# EasyEDA Pro project ProProject_J-Link_WiFi_072_V831_Open_2023-09-08.epro, schematic J-Link_WiFi_072_V831

## Sheets
1 V831: Create Date: 2022-09-12; Page Name: V831; Project Name: J-Link_WiFi_072_V831; Schematic Name: J-Link_WiFi_072_V831; Update Date: 2023-04-10; Company: 嘉立创EDA
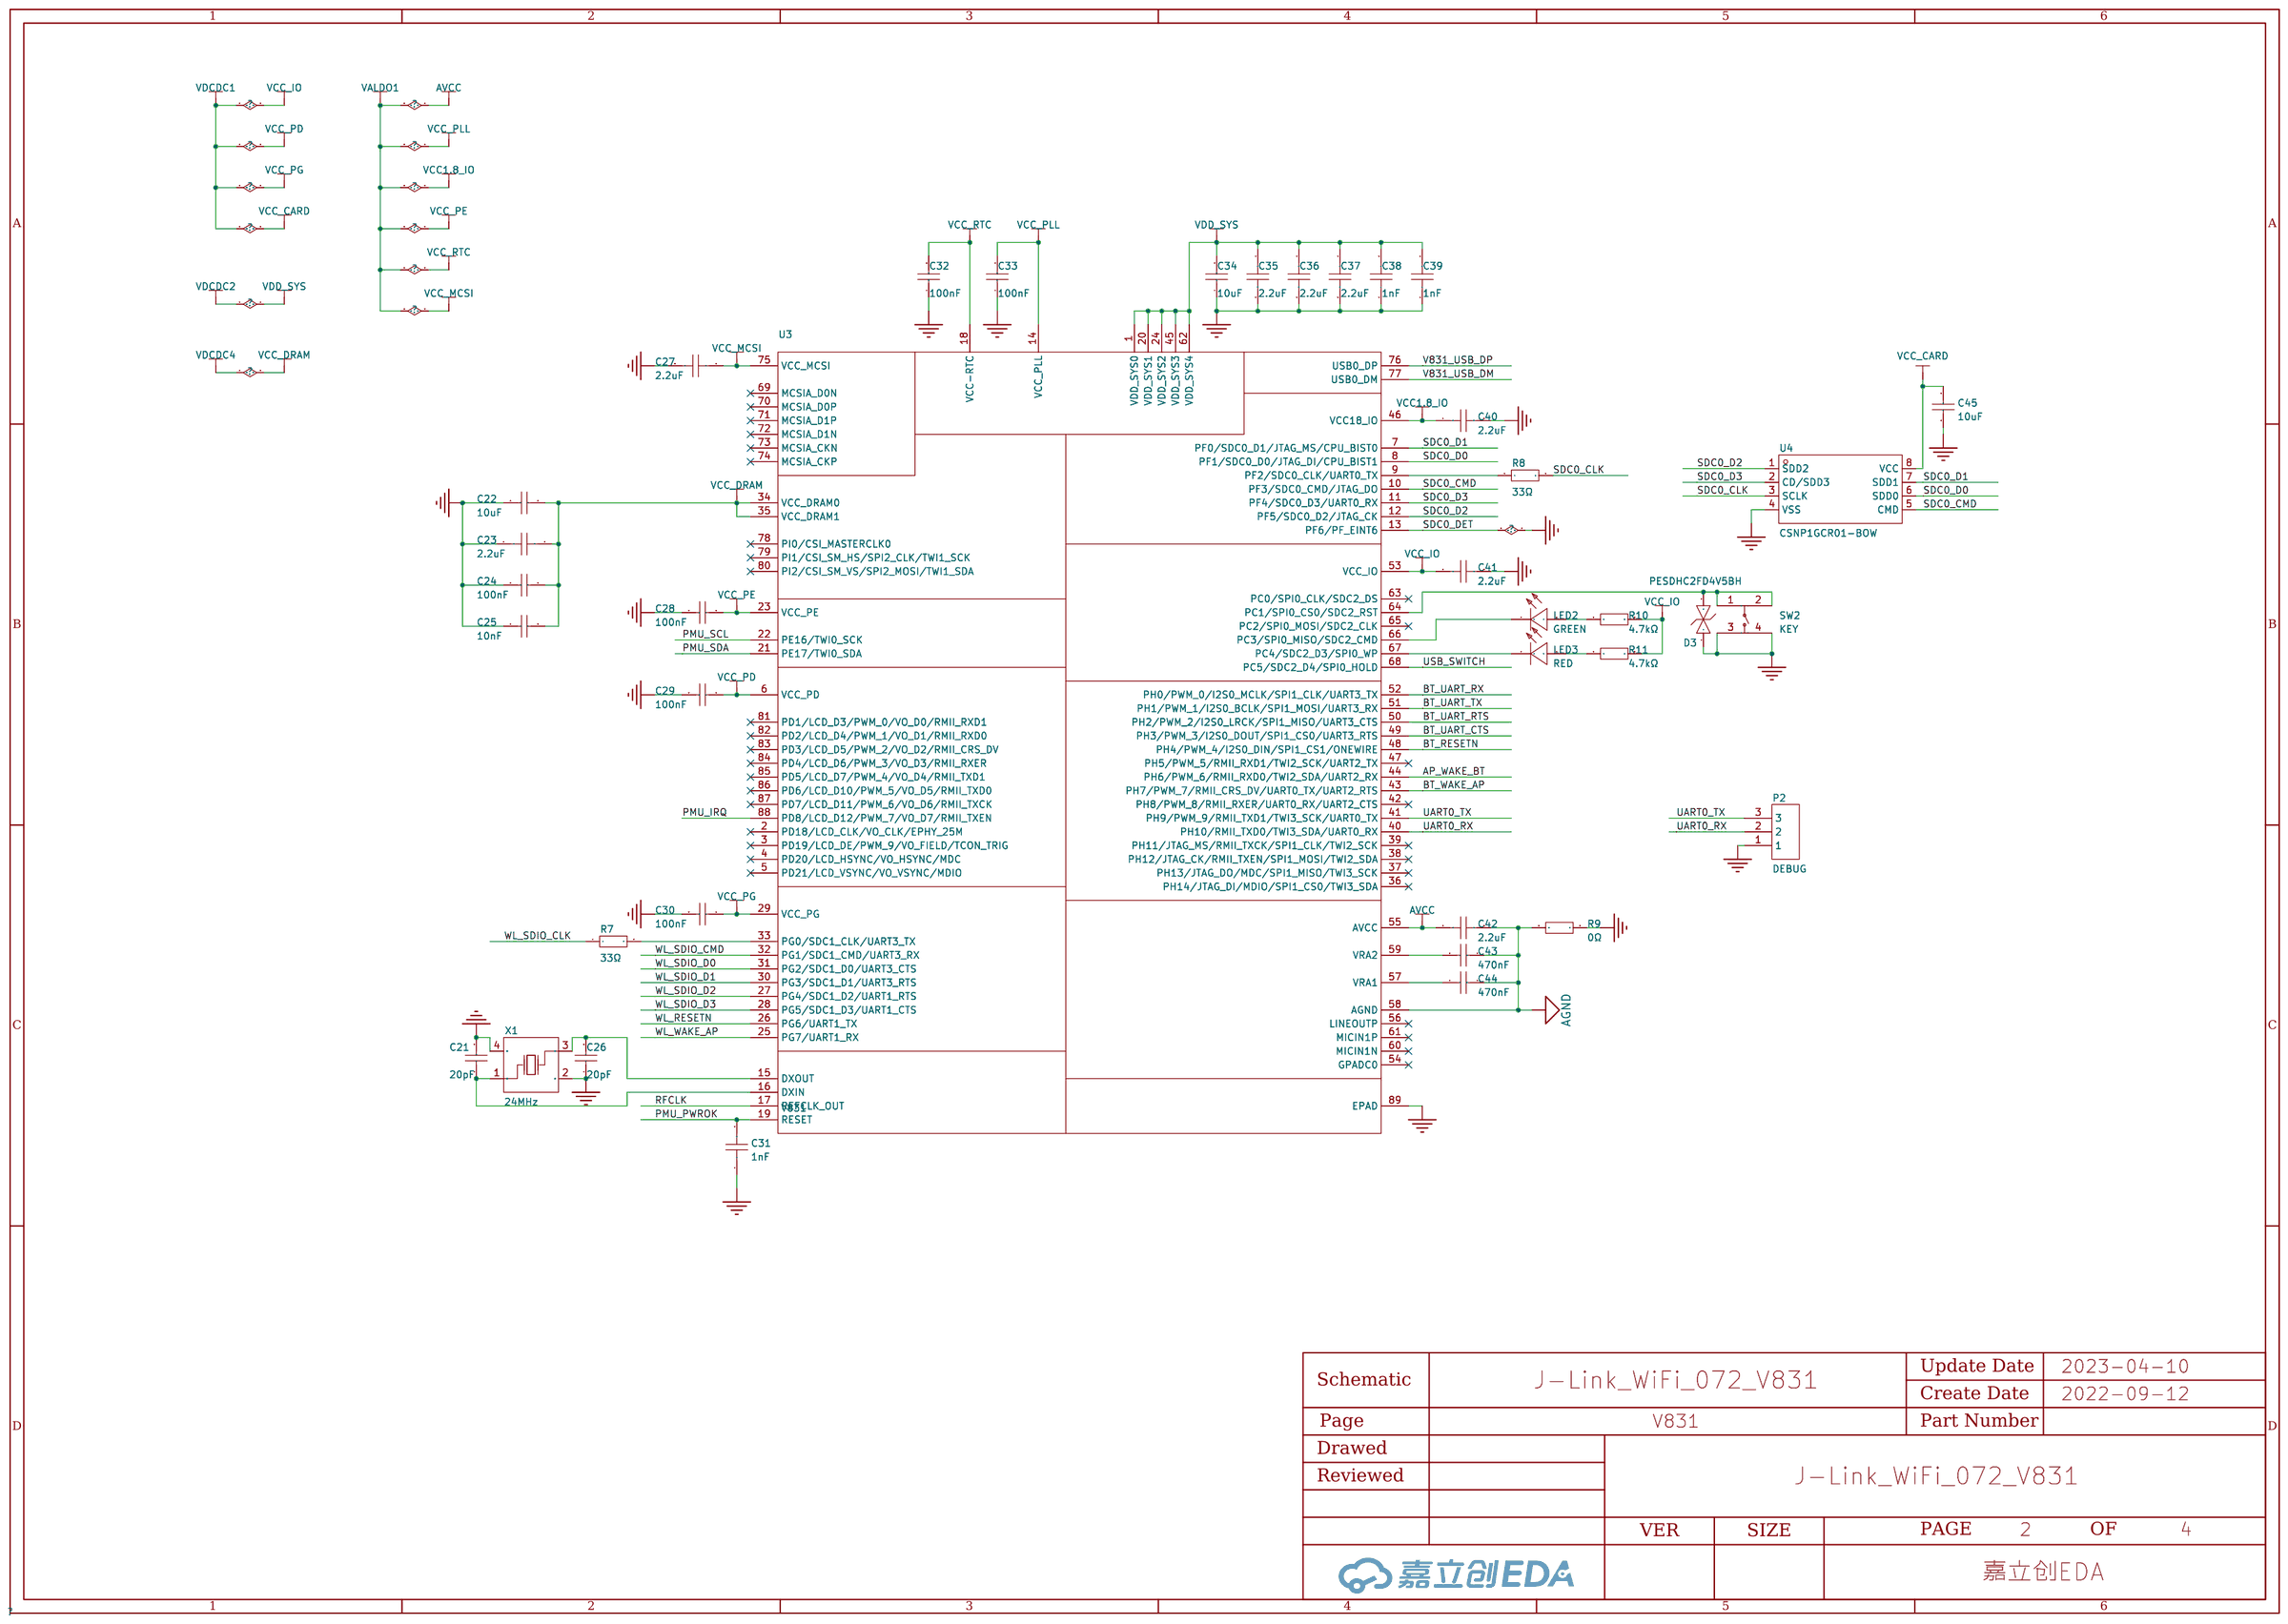
[diagram p0: V831]
2 POWER: Create Date: 2022-09-10; Page Name: POWER; Update Date: 2023-04-09
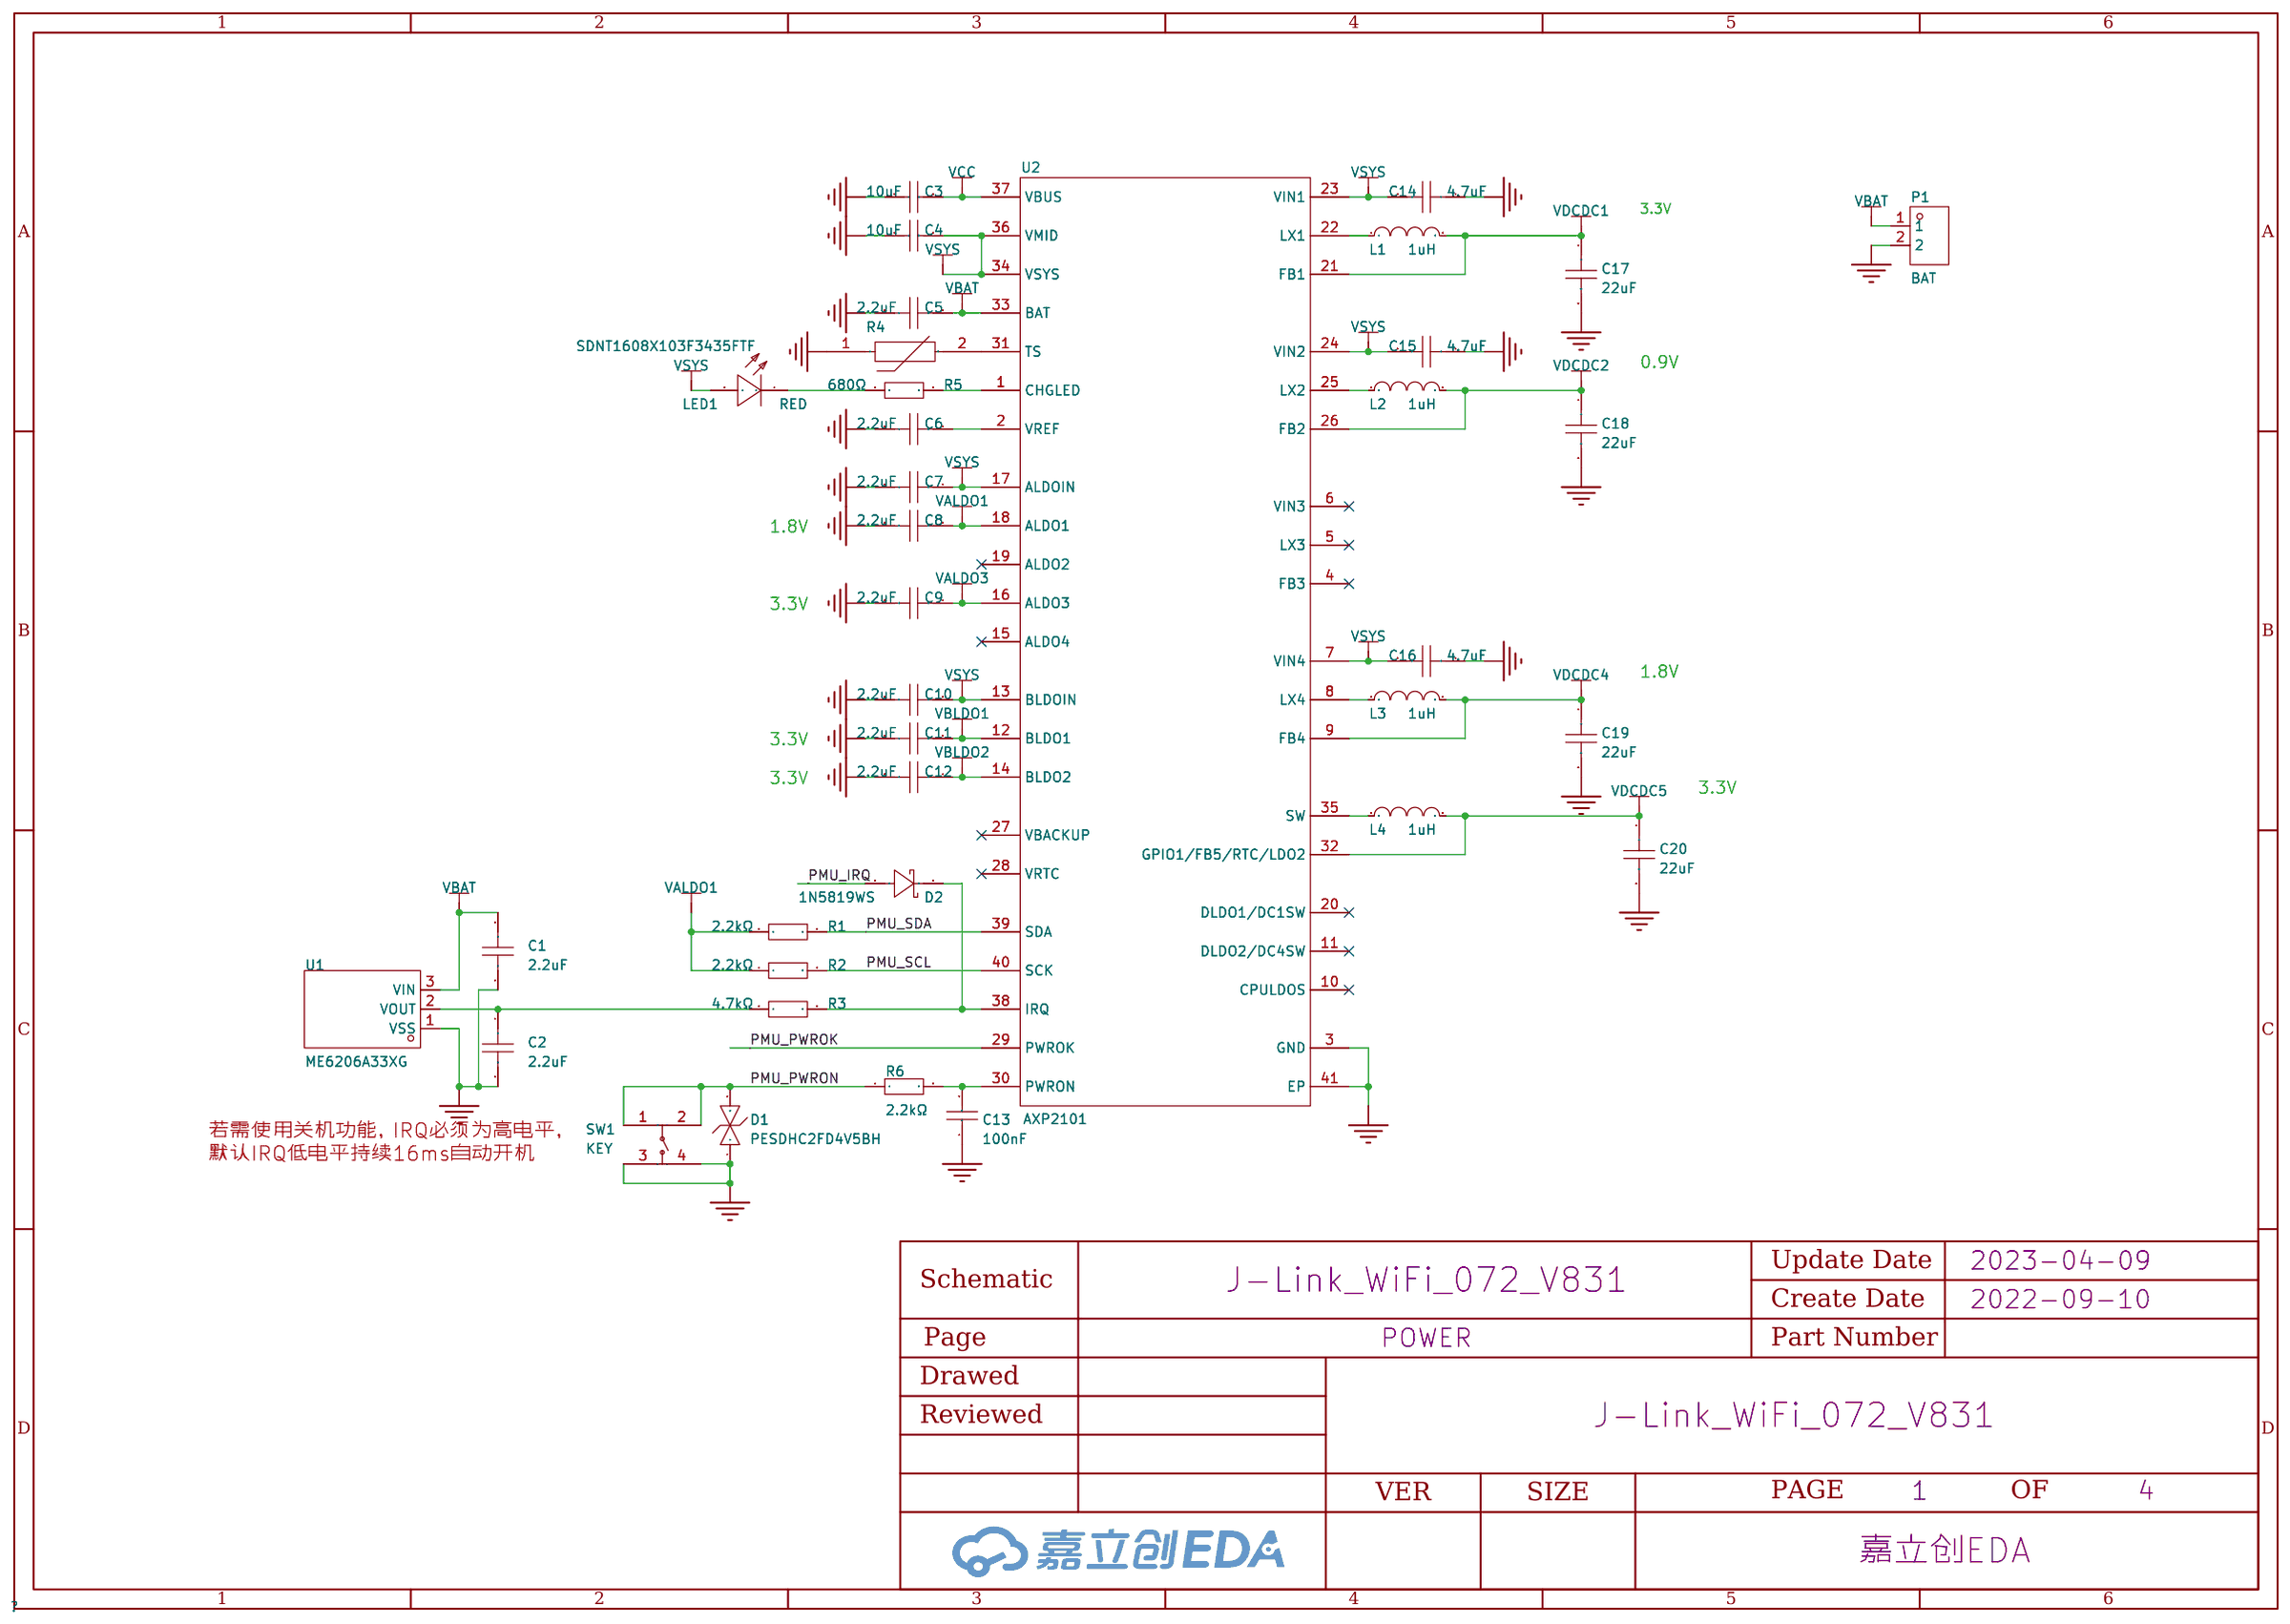
[diagram p1: POWER]
3 WiFi/BLE: Page Name: WiFi/BLE; Update Date: 2022-12-11
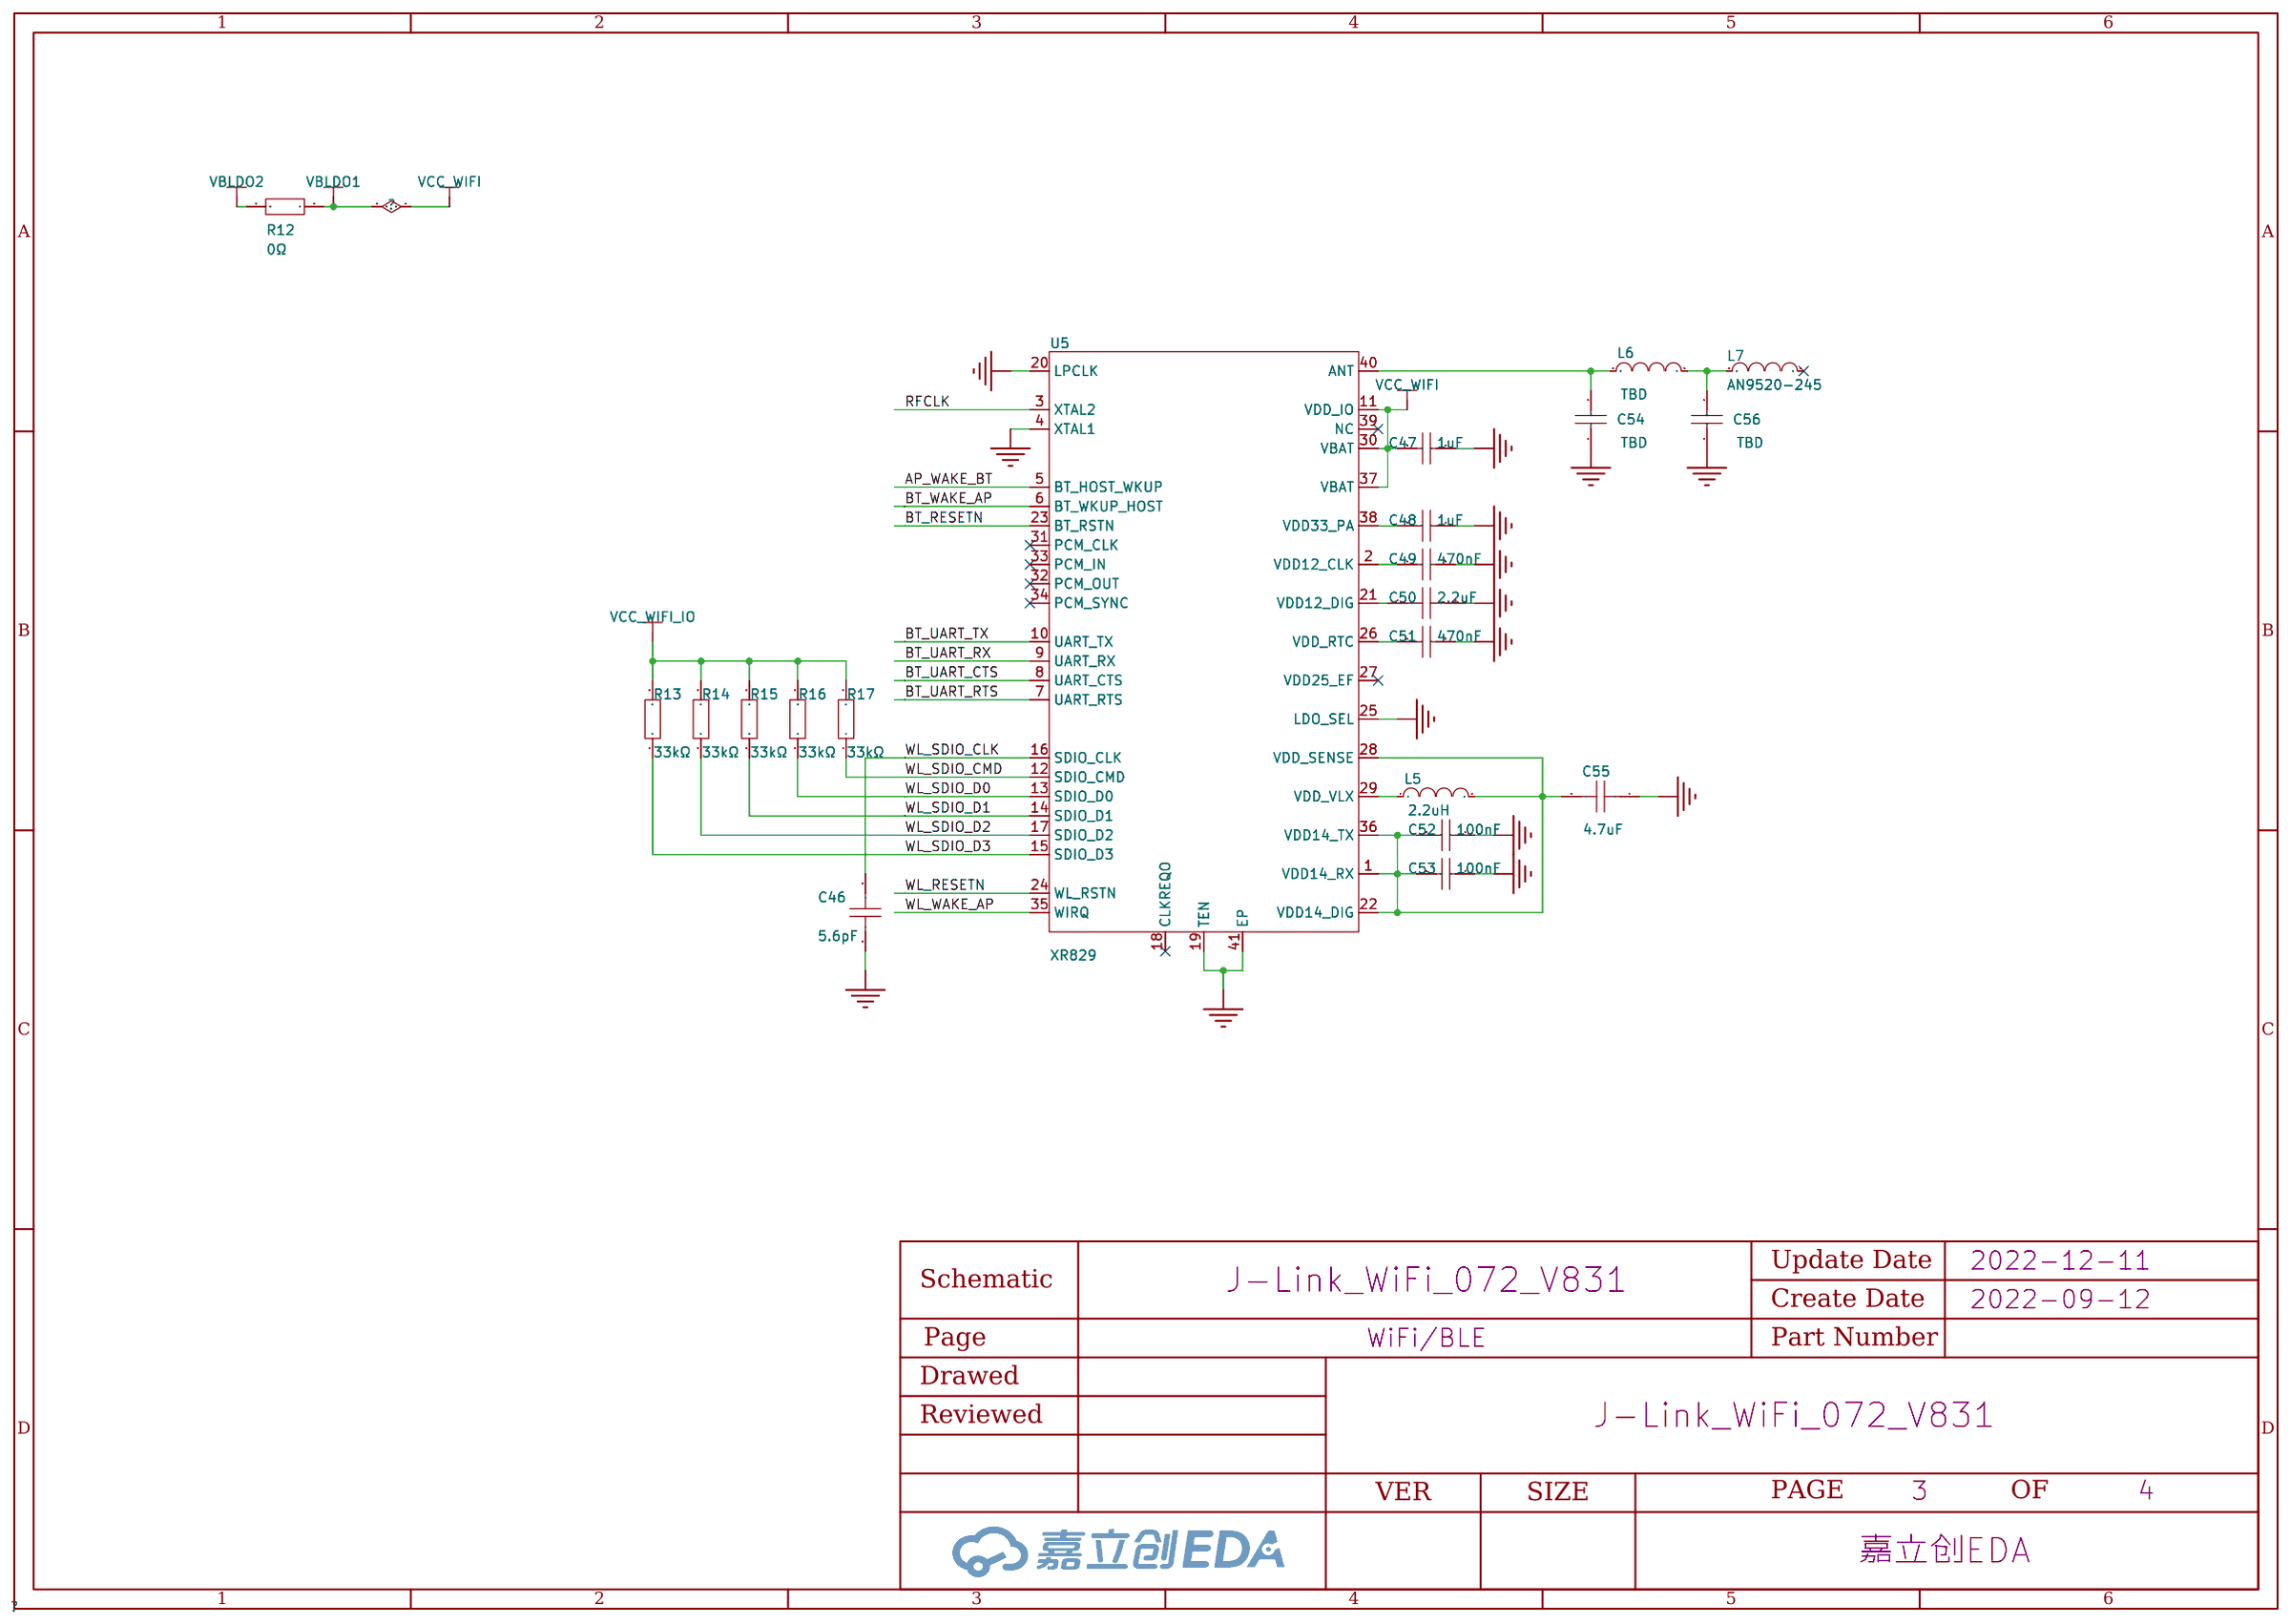
[diagram p2: WiFi/BLE]
4 J-Link 072: Create Date: 2022-09-19; Page Name: J-Link 072; Update Date: 2022-12-07
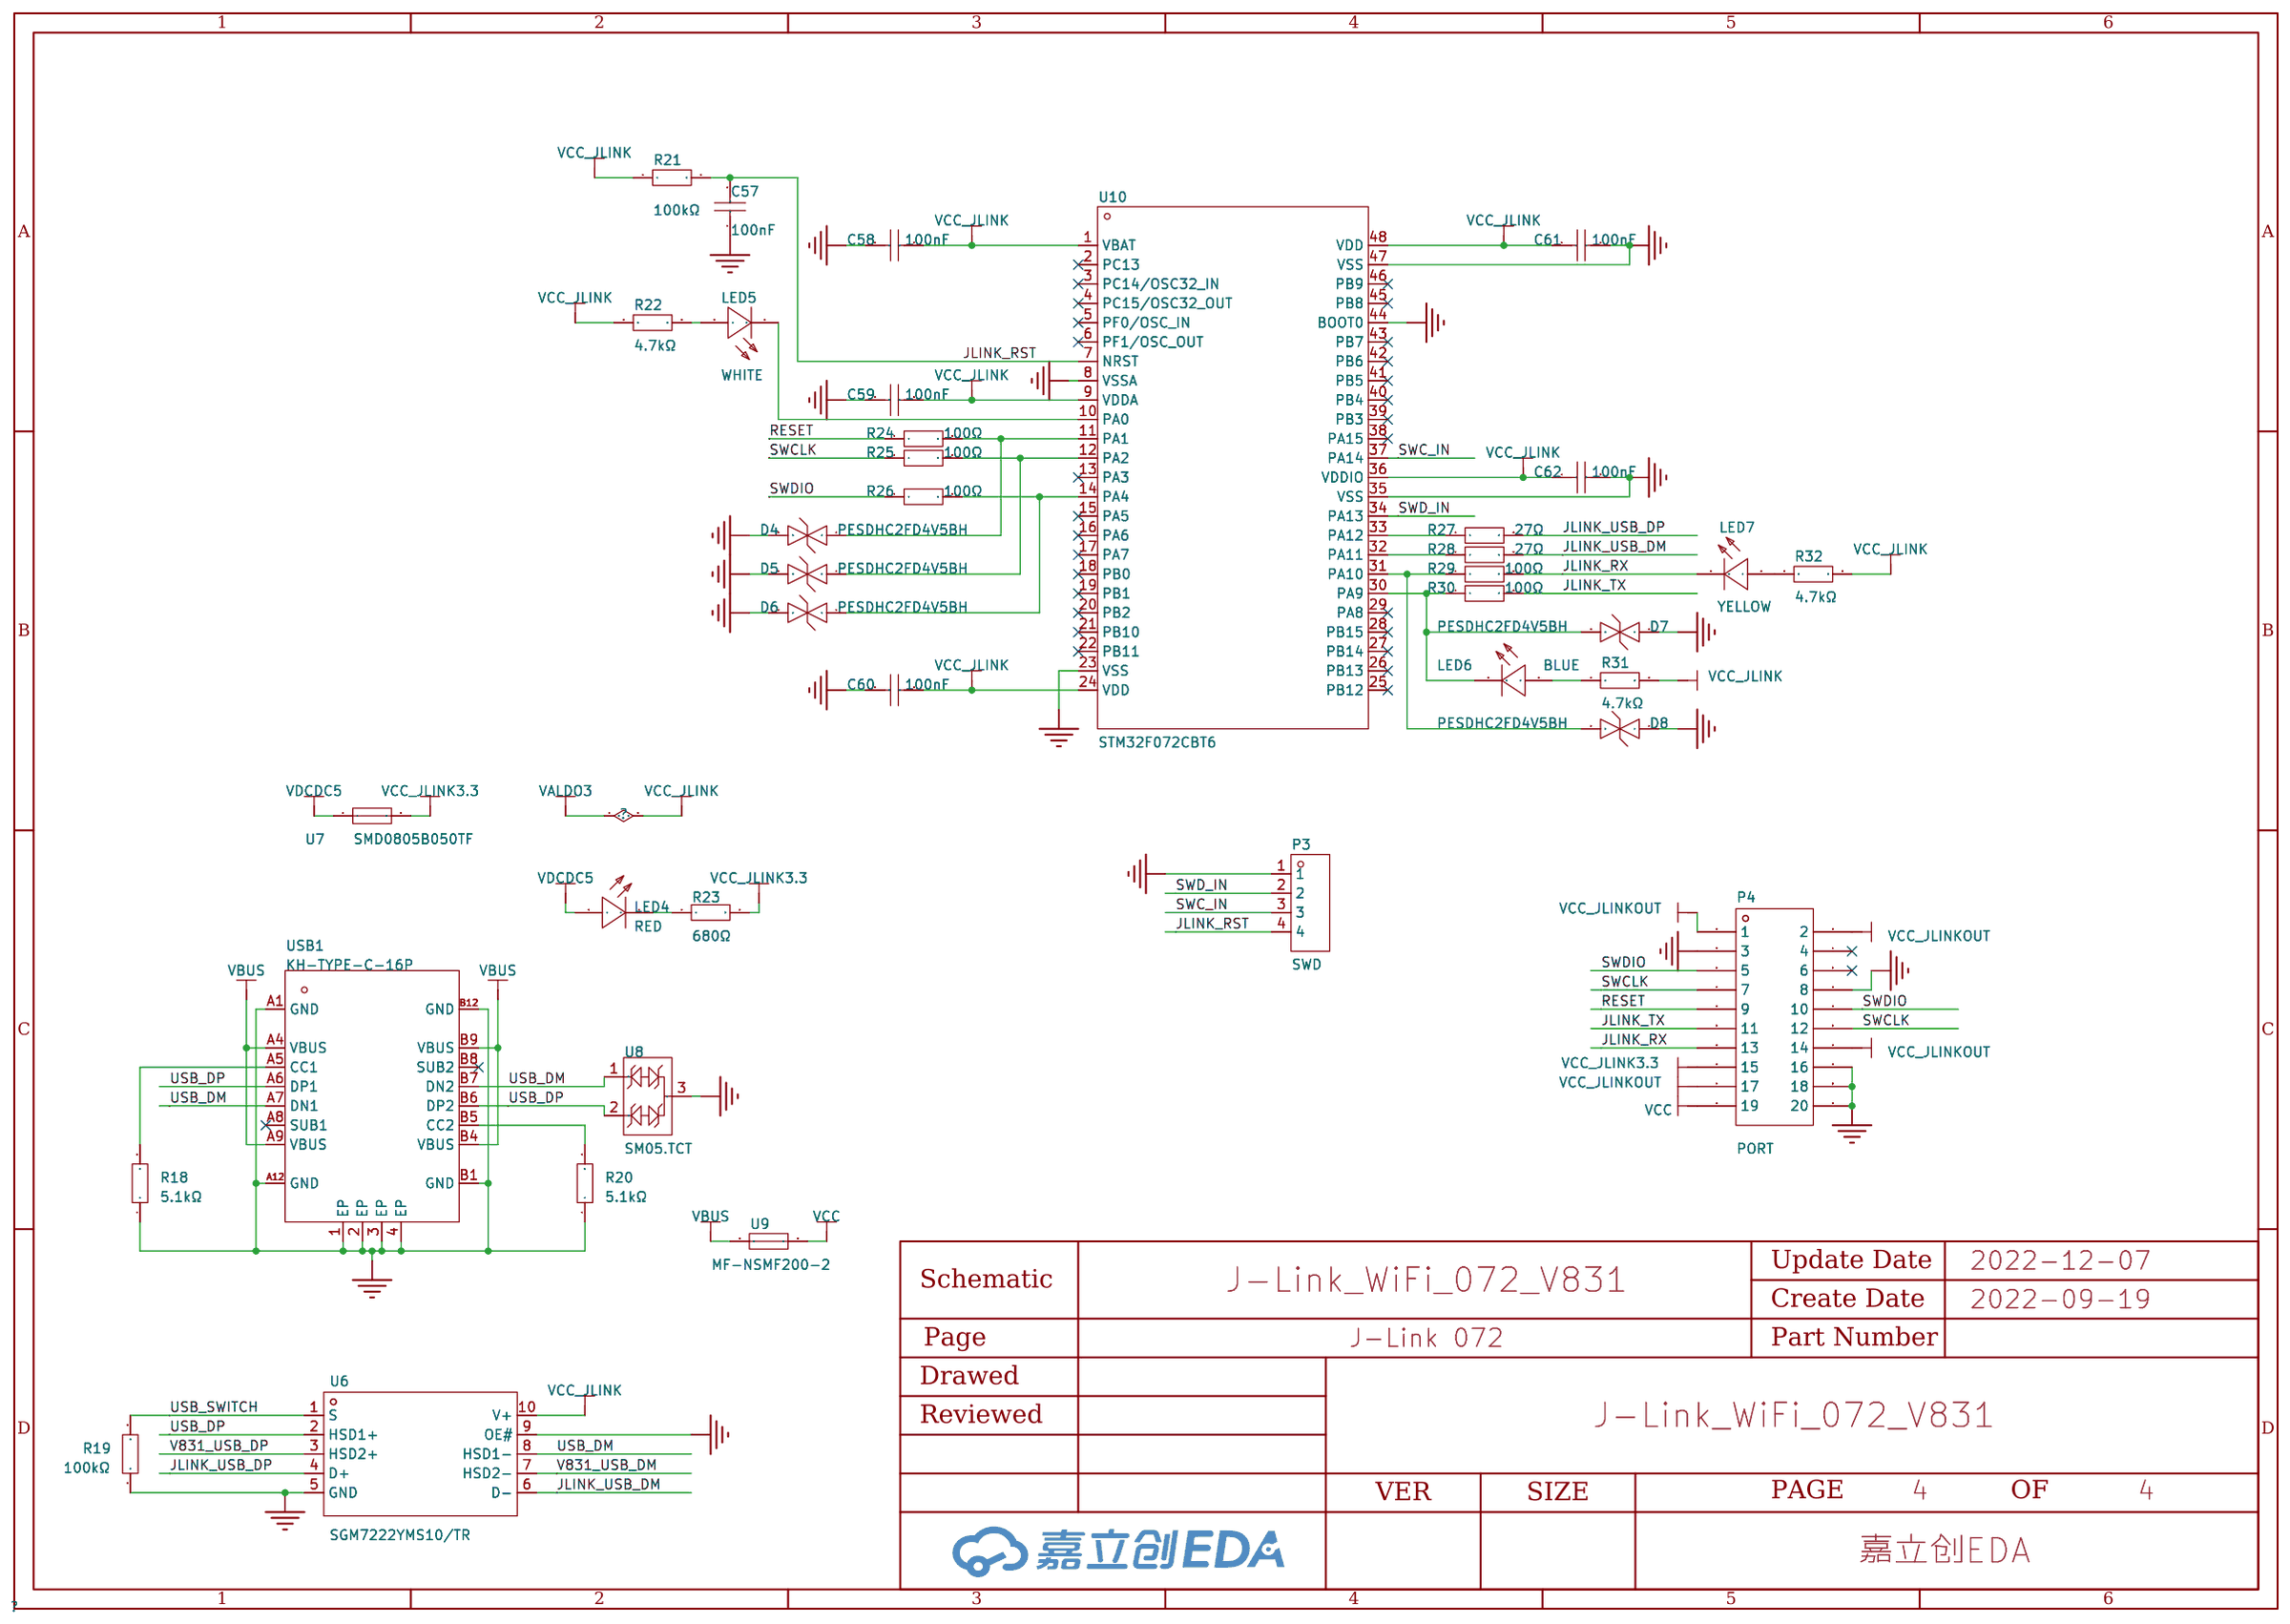
[diagram p3: J-Link 072]

## Parts
sheet J-Link 072
C57  100nF  [C0402]
C58  100nF  [C0402]
C59  100nF  [C0402]
C60  100nF  [C0402]
C61  100nF  [C0402]
C62  100nF  [C0402]
D4  PESDHC2FD4V5BH  [DFN1006-2L-BI]
D5  PESDHC2FD4V5BH  [DFN1006-2L-BI]
D6  PESDHC2FD4V5BH  [DFN1006-2L-BI]
D7  PESDHC2FD4V5BH  [DFN1006-2L-BI]
D8  PESDHC2FD4V5BH  [DFN1006-2L-BI]
LED4  RED  [LED0402-RD]
LED5  WHITE  [LED0402-RD_WHITE]
LED6  BLUE  [LED0402-RD_BLUE]
LED7  YELLOW  [LED0402-RD_YELLOW]
P3  SWD  [HDR-TH_4P-P1.27-V-M]
P4  PORT  [HDR-SMD_20P-P2.54]
R18  5.1kΩ  [R0402]
R19  100kΩ  [R0402]
R20  5.1kΩ  [R0402]
R21  100kΩ  [R0402]
R22  4.7kΩ  [R0402]
R23  680Ω  [R0402]
R24  100Ω  [R0402]
R25  100Ω  [R0402]
R26  100Ω  [R0402]
R27  27Ω  [R0402]
R28  27Ω  [R0402]
R29  100Ω  [R0402]
R30  100Ω  [R0402]
R31  4.7kΩ  [R0402]
R32  4.7kΩ  [R0402]
U6  SGM7222YMS10/TR  [MSOP-10_L3.0-W3.0-P0.50-LS5.0-BL]
U7  SMD0805B050TF  [F0805]
U8  SM05.TCT  [SOT-23-3_L2.9-W1.3-P1.90-LS2.4]
U9  MF-NSMF200-2  [F1206]
U10  STM32F072CBT6  [LQFP-48_L7.0-W7.0-P0.50-LS9.0-BL]
USB1  KH-TYPE-C-16P  [USB-C-SMD_KH-TYPE-C-16P]
sheet POWER
C1  2.2uF  [C0402]
C2  2.2uF  [C0402]
C3  10uF  [C0402]
C4  10uF  [C0402]
C5  2.2uF  [C0402]
C6  2.2uF  [C0402]
C7  2.2uF  [C0402]
C8  2.2uF  [C0402]
C9  2.2uF  [C0402]
C10  2.2uF  [C0402]
C11  2.2uF  [C0402]
C12  2.2uF  [C0402]
C13  100nF  [C0402]
C14  4.7uF  [C0402]
C15  4.7uF  [C0402]
C16  4.7uF  [C0402]
C17  22uF  [C0603]
C18  22uF  [C0603]
C19  22uF  [C0603]
C20  22uF  [C0603]
D1  PESDHC2FD4V5BH  [DFN1006-2L-BI]
D2  1N5819WS  [SOD-323_L1.6-W1.3-LS2.6-RD-1]
L1  1uH  [IND-SMD_L2.5-W2.0_AHP252010X]
L2  1uH  [IND-SMD_L2.5-W2.0_AHP252010X]
L3  1uH  [IND-SMD_L2.5-W2.0_AHP252010X]
L4  1uH  [IND-SMD_L2.5-W2.0_AHP252010X]
LED1  RED  [LED0402-RD]
P1  BAT  [HDR-TH_2P-P1.27-V-M]
R1  2.2kΩ  [R0402]
R2  2.2kΩ  [R0402]
R3  4.7kΩ  [R0402]
R4  SDNT1608X103F3435FTF  [R0603]
R5  680Ω  [R0402]
R6  2.2kΩ  [R0402]
SW1  KEY  [SW-SMD_4P-L4.2-W3.3-P2.15-LS5.1]
U1  ME6206A33XG  [SOT-23-3_L2.9-W1.6-P1.90-LS2.8-BR]
U2  AXP2101  [QFN-40_L5.0-W5.0-P0.40-TL-EP3.4]
sheet V831
C21  20pF  [C0402]
C22  10uF  [C0402]
C23  2.2uF  [C0402]
C24  100nF  [C0402]
C25  10nF  [C0402]
C26  20pF  [C0402]
C27  2.2uF  [C0402]
C28  100nF  [C0402]
C29  100nF  [C0402]
C30  100nF  [C0402]
C31  1nF  [C0402]
C32  100nF  [C0402]
C33  100nF  [C0402]
C34  10uF  [C0402]
C35  2.2uF  [C0402]
C36  2.2uF  [C0402]
C37  2.2uF  [C0402]
C38  1nF  [C0402]
C39  1nF  [C0402]
C40  2.2uF  [C0402]
C41  2.2uF  [C0402]
C42  2.2uF  [C0402]
C43  470nF  [C0402]
C44  470nF  [C0402]
C45  10uF  [C0402]
D3  PESDHC2FD4V5BH  [DFN1006-2L-BI]
LED2  GREEN  [LED0402-RD_GREEN]
LED3  RED  [LED0402-RD]
P2  DEBUG  [HDR-TH_3P-P1.27-V-M-1]
R7  33Ω  [R0402]
R8  33Ω  [R0402]
R9  0Ω  [R0402]
R10  4.7kΩ  [R0402]
R11  4.7kΩ  [R0402]
SW2  KEY  [SW-SMD_4P-L4.2-W3.3-P2.15-LS5.1]
U3  V831  [QFN-88_L9.0-W9.0-P0.35-TL-EP6.5]
U4  CSNP1GCR01-BOW  [LGA-8_L6.0-W8.0-P1.27-TL]
X1  24MHz  [CRYSTAL-SMD_4P-L2.0-W1.6-BL]
sheet WiFi/BLE
C46  5.6pF  [C0402]
C47  1uF  [C0402]
C48  1uF  [C0402]
C49  470nF  [C0402]
C50  2.2uF  [C0402]
C51  470nF  [C0402]
C52  100nF  [C0402]
C53  100nF  [C0402]
C54  TBD  [C0402]
C55  4.7uF  [C0402]
C56  TBD  [C0402]
L5  2.2uH  [IND-SMD_L2.5-W2.0_AHP252010X]
L6  TBD  [L0201]
L7  AN9520-245  [ANT-SMD_L9.5-W2.1]
R12  0Ω  [R0402]
R13  33kΩ  [R0402]
R14  33kΩ  [R0402]
R15  33kΩ  [R0402]
R16  33kΩ  [R0402]
R17  33kΩ  [R0402]
U5  XR829  [QFN-40_L5.0-W5.0-P0.40-BL-EP3.4]

## Library data of the parts
C13 C24 C28-C30 C32 C33 C52 C53 C57-C62 = CC0402KRX7R8BB104: 容值:100nF;精度:±10%;额定电压:25V;材质(温度系数):X7R;; LCSC Part Name: 100nF ±10% 25V; Supplier Part: C105883; Manufacturer: YAGEO(国巨); Supplier Footprint: 0402; JLCPCB Part Class: Extended Part; Datasheet: https://atta.szlcsc.com/upload/public/pdf/source/20170918/C105883_1505726806641976121.pdf; Supplier: LCSC; Tolerance: ±10%; Voltage Rated: 25V; Temperature Coefficient: X7R
D1 D3-D8 = PESDHC2FD4V5BH: 极性:Bidirectional;反向关断电压（典型值）:4.5V (Max);击穿电压（最小值）:-;箝位电压:5.8V;峰值脉冲电流（10/1000us）:1A (8/20us);; Supplier Part: C168625; Manufacturer: Prisemi 芯导; Supplier Footprint: DFN1006; JLCPCB Part Class: Extended Part; Datasheet: https://atta.szlcsc.com/upload/public/pdf/source/20180316/90CCA7E4164612534247152C97B16755.pdf; Supplier: LCSC; Polarity: Bidirectional; Voltage - Reverse Standoff (Typ): 4.5V (Max); Voltage - Clamping (Max) @ Ipp: 5.8V; Current - Peak Pulse (10/1000μs): 1A (8/20us)
LED1 LED3 LED4 = MHT136CRCT: 发光颜色:红灯;二极管配置:-;透镜颜色:无色透明;主波长:617.5nm~633.5nm;峰值波长:632nm;色温:-;光通量(25时):-;测试电流:5mA;正向电压(VF):1.9V;发光强度:36mcd;功率:60mW;发光角度:120°;安装方式:-;工作温度:-35~+85;; LCSC Part Name: LED贴片0402高亮红色光; Supplier Part: C397045; Manufacturer: MEIHUA(美华科技); Supplier Footprint: 0402; JLCPCB Part Class: Extended Part; Datasheet: https://atta.szlcsc.com/upload/public/pdf/source/20190613/C397045_F2F0F7EAC495BEB23889A615F1EA2291.pdf; Supplier: LCSC; Emitted Color: 红灯; Lens Color: 无色透明; Dominant Wavelength: 617.5nm~633.5nm; Peak Wavelength: 632nm; Forward Current: 5mA; Forward Voltage (VF): 1.9V; Luminous Intensity: 36mcd; Power Dissipation: 60mW; Viewing Angle: 120°; Operating Temperature: -35~+85
LED5 = MHT136WDT-C2: 发光颜色:白色;二极管配置:-;透镜颜色:雾状黄;主波长:-;峰值波长:-;色温:-;光通量(25时):-;测试电流:1mA;正向电压(VF):2.9V;发光强度:71mcd;功率:95mW;发光角度:130°;安装方式:-;工作温度:-35~+85;; LCSC Part Name: LED贴片0402高亮白色光冷白; Supplier Part: C397046; Manufacturer: MEIHUA(美华科技); Supplier Footprint: 0402; JLCPCB Part Class: Extended Part; Datasheet: https://atta.szlcsc.com/upload/public/pdf/source/20190613/C397046_5CACA7179AA86E0F80D2D379FCAA6DAE.pdf; Supplier: LCSC; Emitted Color: 白色; Lens Color: 雾状黄; Forward Current: 1mA; Forward Voltage (VF): 2.9V; Luminous Intensity: 71mcd; Power Dissipation: 95mW; Viewing Angle: 130°; Operating Temperature: -35~+85
LED6 = MHT136UBCT: 发光颜色:蓝灯;二极管配置:-;透镜颜色:无色透明;主波长:460nm~475nm;峰值波长:468nm;色温:-;光通量(25时):-;测试电流:5mA;正向电压(VF):3V;发光强度:72mcd;功率:95mW;发光角度:120°;安装方式:-;工作温度:-35~+85;; LCSC Part Name: LED贴片0402高亮蓝色光; Supplier Part: C401112; Manufacturer: MEIHUA(美华科技); Supplier Footprint: 0402; JLCPCB Part Class: Extended Part; Datasheet: https://atta.szlcsc.com/upload/public/pdf/source/20190702/C401112_5DC3FC64C29106EB5A730797BBB1C3EC.pdf; Supplier: LCSC; Emitted Color: 蓝灯; Lens Color: 无色透明; Dominant Wavelength: 460nm~475nm; Peak Wavelength: 468nm; Forward Current: 5mA; Forward Voltage (VF): 3V; Luminous Intensity: 72mcd; Power Dissipation: 95mW; Viewing Angle: 120°; Operating Temperature: -35~+85
LED7 = MHT136CYCT: 发光颜色:黄灯;二极管配置:-;透镜颜色:无色透明;主波长:582.5nm~594.5nm;峰值波长:591nm;色温:-;光通量(25时):-;测试电流:5mA;正向电压(VF):2.2V;发光强度:45mcd;功率:60mW;发光角度:120°;安装方式:-;工作温度:-35~+85;; LCSC Part Name: LED贴片0402高亮黄色光; Supplier Part: C401110; Manufacturer: MEIHUA(美华科技); Supplier Footprint: 0402; JLCPCB Part Class: Extended Part; Datasheet: https://atta.szlcsc.com/upload/public/pdf/source/20190702/C401110_3E02D14D88D2DCD37BFC11BA2178CD0B.pdf; Supplier: LCSC; Emitted Color: 黄灯; Lens Color: 无色透明; Dominant Wavelength: 582.5nm~594.5nm; Peak Wavelength: 591nm; Forward Current: 5mA; Forward Voltage (VF): 2.2V; Luminous Intensity: 45mcd; Power Dissipation: 60mW; Viewing Angle: 120°; Operating Temperature: -35~+85
P3 = DZ127R-11-04-25: 间距:1.27mm;总PIN位数:4;排数:1;插针结构:1x4P;行距:-;安装类型:直插;圆针/方针:方针;额定电流:1A;额定电压:-;配合针长度:3mm;塑高:1mm;端接针长度:2.5mm;工作温度范围:-;颜色:-;; LCSC Part Name: 1.27mm 1x4P 直插 方针; Supplier Part: C2935944; Manufacturer: DEALON(德艺隆); Supplier Footprint: 插件,P=1.27mm; JLCPCB Part Class: Extended Part; Datasheet: https://atta.szlcsc.com/upload/public/pdf/source/20211231/4B9AD700BD723B1CCECE5D1F1C49AFB9.pdf; Supplier: LCSC; Pitch: 1.27mm; Number of Pins: 4; Number of Rows: 1; Pin Structure: 1x4P; Mounting Type: 直插; Circluar Pins/Square Pins: 方针; Current Rating (Max): 1A; Length of Mating Pin: 3mm; Insulation Height: 1mm; Length of End Connection Pin: 2.5mm
P4 = HDR2x10_SMD: 间距:2.54mm;总PIN位数:20;排数:2;插针结构:2x10P;行距:2.54mm;安装类型:直插;圆针/方针:-;额定电流:-;额定电压:-;配合针长度:6mm;塑高:2.54mm;端接针长度:3mm;触头材质:黄铜;触头镀层:-;工作温度范围:-40~+105;颜色:黑色;; LCSC Part Name: 2.54mm 2x10P 直插; Supplier Part: C124359; Manufacturer: Ckmtw(灿科盟); Manufacturer Part: B-2100S20P-B110; Supplier Footprint: 插件,P=2.54mm; JLCPCB Part Class: Extended Part; Datasheet: https://atta.szlcsc.com/upload/public/pdf/source/20170821/C124359_1503303298039901511.pdf; Supplier: LCSC; Pitch: 2.54mm; Number of Pins: 20; Number of Rows: 2; Pin Structure: 2x10P; Row Spacing: 2.54mm; Mounting Type: 直插; Length of Mating Pin: 6mm; Insulation Height: 2.54mm; Length of End Connection Pin: 3mm; Contact Material: 黄铜; Operating Temperature Range: -40~+105; Color: 黑色
R18 R20 = RC0402FR-075K1L: 阻值:5.1kΩ;精度:±1%;功率:62.5mW;温度系数:±100ppm/;最大工作电压:50V;工作温度范围:-55~+155;; LCSC Part Name: 5.1kΩ ±1% 62.5mW; Supplier Part: C105872; Manufacturer: YAGEO(国巨); Supplier Footprint: 0402; JLCPCB Part Class: Extended Part; Datasheet: https://atta.szlcsc.com/upload/public/pdf/source/20170912/C105872_1505207464555963229.pdf; Supplier: LCSC; Tolerance: ±1%; Power(Watts): 62.5mW; Temperature Coefficient: ±100ppm/; Overload Voltage (Max): 50V; Operating Temperature Range: -55~+155
R19 R21 = AC0402FR-07100KL: 电阻类型:厚膜电阻;阻值:100kΩ;精度:±1%;功率:62.5mW;温度系数:±100ppm/;最大工作电压:50V;工作温度范围:-55~+155;; LCSC Part Name: 100kΩ ±1%; Supplier Part: C144809; Manufacturer: YAGEO(国巨); Supplier Footprint: 0402; JLCPCB Part Class: Extended Part; Datasheet: https://atta.szlcsc.com/upload/public/pdf/source/20171225/C144809_15141880836601203001.pdf; Supplier: LCSC; Type: 厚膜电阻; Tolerance: ±1%; Power(Watts): 62.5mW; Temperature Coefficient: ±100ppm/; Overload Voltage (Max): 50V; Operating Temperature Range: -55~+155
R3 R10 R11 R22 R31 R32 = RC0402FR-074K7L: 阻值:4.7kΩ;精度:±1%;功率:62.5mW;温度系数:±100ppm/;最大工作电压:50V;工作温度范围:-55~+155;; LCSC Part Name: 4.7kΩ ±1% 62.5mW; Supplier Part: C105871; Manufacturer: YAGEO(国巨); Supplier Footprint: 0402; JLCPCB Part Class: Extended Part; Datasheet: https://atta.szlcsc.com/upload/public/pdf/source/20170912/C105871_1505207463959963228.pdf; Supplier: LCSC; Tolerance: ±1%; Power(Watts): 62.5mW; Temperature Coefficient: ±100ppm/; Overload Voltage (Max): 50V; Operating Temperature Range: -55~+155
R5 R23 = 0402WGF6800TCE: 电阻类型:厚膜电阻;阻值:680Ω;精度:±1%;功率:1/16W;温度系数:±100ppm/;最大工作电压:50V;工作温度范围:-55~+155;; LCSC Part Name: 680Ω ±1%; Supplier Part: C25130; Manufacturer: UNI-ROYAL(厚声); Supplier Footprint: 0402; JLCPCB Part Class: Basic Part; Datasheet: https://atta.szlcsc.com/upload/public/pdf/source/20200306/C422600_1E6D84923E4A46A82E41ADD87F860B5C.pdf; Supplier: LCSC; Type: 厚膜电阻; Tolerance: ±1%; Power(Watts): 1/16W; Temperature Coefficient: ±100ppm/; Overload Voltage (Max): 50V; Operating Temperature Range: -55~+155
R24-R26 R29 R30 = RC0402FR-07100RL: 电阻类型:厚膜电阻;阻值:100Ω;精度:±1%;功率:62.5mW;温度系数:±100ppm/;最大工作电压:50V;工作温度范围:-55~+155;; LCSC Part Name: 100Ω ±1% 62.5mW; Supplier Part: C106232; Manufacturer: YAGEO(国巨); Supplier Footprint: 0402; JLCPCB Part Class: Extended Part; Datasheet: https://atta.szlcsc.com/upload/public/pdf/source/20170518/1495085712869.pdf; Supplier: LCSC; Type: 厚膜电阻; Tolerance: ±1%; Power(Watts): 62.5mW; Temperature Coefficient: ±100ppm/; Overload Voltage (Max): 50V; Operating Temperature Range: -55~+155
R27 R28 = RTT0227R0FTH: 电阻类型:厚膜电阻;阻值:27Ω;精度:±1%;功率:1/16W;温度系数:±100ppm/;最大工作电压:50V;工作温度范围:-55~+155;; LCSC Part Name: 27Ω ±1%; Supplier Part: C102944; Manufacturer: RALEC(旺诠); Supplier Footprint: 0402; JLCPCB Part Class: Extended Part; Datasheet: https://atta.szlcsc.com/upload/public/pdf/source/20170408/1491642669081.pdf; Supplier: LCSC; Type: 厚膜电阻; Tolerance: ±1%; Power(Watts): 1/16W; Temperature Coefficient: ±100ppm/; Overload Voltage (Max): 50V; Operating Temperature Range: -55~+155
U6 = SGM7222YMS10/TR: 开关电路:-;多路复用器/解复用器电路:-;导通电阻（最大值）:-;开关电压（最大值）:-;; Supplier Part: C113292; Manufacturer: SGMICRO(圣邦微); Supplier Footprint: MSOP-10; JLCPCB Part Class: Extended Part; Datasheet: https://atta.szlcsc.com/upload/public/pdf/source/20170712/C113292_1499832269144814226.pdf; Supplier: LCSC
U7 = SMD0805B050TF: 最大电压:6V;最大电流:100A;保持电流:500mA;跳闸电流:1A;最大动作时间:100ms;; LCSC Part Name: 6V 0.5A; Supplier Part: C269104; Manufacturer: Brightking(君耀电子); Supplier Footprint: 0805; JLCPCB Part Class: Extended Part; Datasheet: https://atta.szlcsc.com/upload/public/pdf/source/20180814/C269104_466839A5DB65F6E723CA6A162ACE747B.pdf; Supplier: LCSC; Operating Voltage (Max): 6V; Current Rating (Max): 100A; Hold Current: 500mA; Trip Current: 1A; Maximum Time to Trip: 100ms
U8 = SM05.TCT_1: Supplier Part: C2687125; Manufacturer: UMW(友台半导体); Supplier Footprint: SOT-23; JLCPCB Part Class: Extended Part; Datasheet: https://atta.szlcsc.com/upload/public/pdf/source/20210120/C2687125_0DDB88BEB8C57F11DBF69F9810D24A13.pdf; Supplier: LCSC
U9 = MF-NSMF200-2: 最大电压:6V;最大电流:100A;保持电流:2A;跳闸电流:4A;; LCSC Part Name: 2.0A 6V 自恢复保险丝; Supplier Part: C89656; Manufacturer: BOURNS; Supplier Footprint: 1206; JLCPCB Part Class: Extended Part; Datasheet: https://atta.szlcsc.com/upload/public/pdf/source/20161125/1480068355439.pdf; Supplier: LCSC; Operating Voltage (Max): 6V; Current Rating (Max): 100A; Hold Current: 2A; Trip Current: 4A
U10 = STM32F072CBT6: CPU内核:ARM® Cortex®-M0;工作电压:1.65V ~ 3.6V;; Supplier Part: C81720; Manufacturer: ST(意法半导体); Supplier Footprint: LQFP-48_7x7x05P; JLCPCB Part Class: Extended Part; Datasheet: https://atta.szlcsc.com/upload/public/pdf/source/20170428/1493376825827.pdf; Supplier: LCSC; Core Processor: ARM® Cortex®-M0; Voltage - Supply (Vcc/Vdd): 1.65V ~ 3.6V; RAM Size: 16KB; Number of I/O: 37; A/D: 10x12bit; D/A: 2x12bit; PWM: 6; UART/USART: 4 USART; I2C（SMBUS/PMBUS）: 2; USB Device: 1; CAN: 1; Features: I2S,HDMI CEC
USB1 = KH-TYPE-C-16P: 连接器类型:Type-C;标准:-;公母:母座;触点数量:16;端口数量:1;安装方式:卧贴;额定电流 - 电源:3A;工作温度范围:-40~+85;; LCSC Part Name: Type-C 母座 卧贴; Supplier Part: C709357; Manufacturer: kinghelm(金航标); Supplier Footprint: SMD; JLCPCB Part Class: Extended Part; Datasheet: https://atta.szlcsc.com/upload/public/pdf/source/20200911/C709357_AA8DCEB38BB20E3035A7ED7AE7667837.pdf; Supplier: LCSC; Connector Type: Type-C; Gender: 母座; Number of Contacts: 16; Number of Ports: 1; Mounting Style: 卧贴; Current Rating - Power (Max): 3A; Operating Temperature Range: -40~+85
C1 C2 C5-C12 C23 C27 C35-C37 C40-C42 C50 = CL05A225MQ5NNNC: 容值:2.2uF;精度:±20%;额定电压:6.3V;材质(温度系数):X5R;; LCSC Part Name: 2.2uF ±20% 6.3V; Supplier Part: C107371; Manufacturer: SAMSUNG(三星); Supplier Footprint: 0402; JLCPCB Part Class: Extended Part; Datasheet: https://atta.szlcsc.com/upload/public/pdf/source/20180125/C107371_15168614220061301441.pdf; Supplier: LCSC; Tolerance: ±20%; Voltage Rated: 6.3V; Temperature Coefficient: X5R
C3 C4 C22 C34 C45 = CL05A106MQ5NUNC: 容值:10uF;精度:±20%;额定电压:6.3V;材质(温度系数):X5R;; LCSC Part Name: 10uF ±20% 6.3V; Supplier Part: C15525; Manufacturer: SAMSUNG(三星); Supplier Footprint: 0402; JLCPCB Part Class: Basic Part; Datasheet: https://atta.szlcsc.com/upload/public/pdf/source/20220823/2B02EE04F8F211D38A52DCB16EB6BEBA.pdf; Supplier: LCSC; Tolerance: ±20%; Voltage Rated: 6.3V; Temperature Coefficient: X5R
C14-C16 = CL05A475MQ5NRNC: 容值:4.7uF;精度:±20%;额定电压:6.3V;温度系数:X5R;; LCSC Part Name: 4.7uF ±20% 6.3V; Supplier Part: C307423; Manufacturer: SAMSUNG(三星); Supplier Footprint: 0402; JLCPCB Part Class: Extended Part; Datasheet: https://atta.szlcsc.com/upload/public/pdf/source/20181010/C307423_0E0C4E35F3A09F81C2E5C84E00499E42.pdf; Supplier: LCSC; Tolerance: ±20%; Voltage Rated: 6.3V; Temperature Coefficient: X5R
C17-C20 = CL10A226MQ8NRNE: 容值:22uF;精度:±20%;额定电压:6.3V;材质(温度系数):X5R;; LCSC Part Name: 22uF ±20% 6.3V; Supplier Part: C159801; Manufacturer: SAMSUNG(三星); Supplier Footprint: 0603; JLCPCB Part Class: Extended Part; Datasheet: https://atta.szlcsc.com/upload/public/pdf/source/20171221/C159801_15138400201591196189.pdf; Supplier: LCSC; Tolerance: ±20%; Voltage Rated: 6.3V; Temperature Coefficient: X5R
D2 = 1N5819WS: 直流反向耐压(Vr):40V;平均整流电流(Io):1A;正向压降(Vf):580mV@1A;反向电流(Ir):50uA@40V;; LCSC Part Name: 40V 1A 580mV@1A; Supplier Part: C2903903; Manufacturer: GOODWORK(固得沃克); Supplier Footprint: SOD-323; JLCPCB Part Class: Extended Part; Datasheet: https://atta.szlcsc.com/upload/public/pdf/source/20220114/BF6ECC8ED918A91A4FEA6F25B6F03A5F.pdf; Supplier: LCSC; Reverse Voltage (Vr): 40V; Average Rectified Current (Io): 1A; Forward Voltage (Vf@If): 580mV@1A; Reverse Leakage Current (Ir): 50uA@40V
L1-L4 = SWPA252012S1R0MT: 精度:±30%;额定电流:-;电感值:1uH;直流电阻(DCR):-;; LCSC Part Name: 1.0uH   ±20%; Supplier Part: C66001; Manufacturer: Sunlord(顺络); Supplier Footprint: SMD; JLCPCB Part Class: Extended Part; Datasheet: https://atta.szlcsc.com/upload/public/pdf/source/20160107/1457707747659.pdf; Supplier: LCSC; Width: 2mm; Tolerance: ±30%; Length: 2.5mm; Height: 1.2mm
P1 = 1.27-1*2P针: 间距:1.27mm;总PIN位数:2;排数:1;插针结构:1x2P;行距:-;安装类型:直插;圆针/方针:方针;额定电流:3A;额定电压:-;配合针长度:3mm;塑高:1.7mm;端接针长度:2.5mm;触头材质:黄铜;触头镀层:-;工作温度范围:-55~+105;颜色:黑色;; LCSC Part Name: 1.27mm 1x2P 直插 方针; Supplier Part: C703015; Manufacturer: BOOMELE(博穆精密); Supplier Footprint: 直插,P=1.27mm; JLCPCB Part Class: Extended Part; Datasheet: https://atta.szlcsc.com/upload/public/pdf/source/20210902/5C150484D45C6948DF4AB04E914DF562.pdf; Supplier: LCSC; Pitch: 1.27mm; Number of Pins: 2; Number of Rows: 1; Pin Structure: 1x2P; Mounting Type: 直插; Circluar Pins/Square Pins: 方针; Current Rating (Max): 3A; Length of Mating Pin: 3mm; Insulation Height: 1.7mm; Length of End Connection Pin: 2.5mm; Contact Material: 黄铜; Operating Temperature Range: -55~+105; Color: 黑色
R1 R2 R6 = 0402WGF2201TCE: 电阻类型:厚膜电阻;阻值:2.2kΩ;精度:±1%;功率:62.5mW;温度系数:±100ppm/;最大工作电压:50V;工作温度范围:-55~+155;; LCSC Part Name: 2.2kΩ ±1% 62.5mW; Supplier Part: C25879; Manufacturer: UNI-ROYAL(厚声); Supplier Footprint: 0402; JLCPCB Part Class: Basic Part; Datasheet: https://atta.szlcsc.com/upload/public/pdf/source/20200306/C422600_1E6D84923E4A46A82E41ADD87F860B5C.pdf; Supplier: LCSC; Type: 厚膜电阻; Tolerance: ±1%; Power(Watts): 62.5mW; Temperature Coefficient: ±100ppm/; Overload Voltage (Max): 50V; Operating Temperature Range: -55~+155
R4 = SDNT1608X103F3435FTF: 阻值(25):10kΩ;电阻精度:±1%;B值精度:±1%;B值(25/50):3435K;功率:-;最大稳态电流(25):-;B值(25/75):-;B值(25/85):-;B值(25/100):-;工作温度:-55~+125;; LCSC Part Name: 10kΩ 电阻精度:±1% 3435K; Supplier Part: C525660; Manufacturer: Sunlord(顺络); Supplier Footprint: 0603; JLCPCB Part Class: Extended Part; Datasheet: https://atta.szlcsc.com/upload/public/pdf/source/20210916/BF106A3565EDFEB141CB3E0EA3A661F8.pdf; Supplier: LCSC; Resistance @ 25℃: 10kΩ; Resistance Tolerance: ±1%; B Constant Tolerance: ±1%; B Constant (25℃/50℃): 3435K; Operating Temperature: -55~+125
SW1 SW2 = TS-1089S-AR02516: 342.5 160GF 轻触开关; LCSC Part Name: 342.5 160gf 轻触开关; Supplier Part: C720479; Manufacturer: XUNPU(讯普); Supplier Footprint: 342.5mm; JLCPCB Part Class: Extended Part; Datasheet: https://atta.szlcsc.com/upload/public/pdf/source/20200810/C720479_389650BB8B865DD3822BD59B78D6CF64.pdf; Supplier: LCSC
U1 = ME6206A33XG: 最大输入电压:6V;压降(max):400mV @ 200mA;输出电压(可调):-;静态电流(Iq):-;输出类型:固定;输出电压(固定):3.3V;; Supplier Part: C161345; Manufacturer: MICRONE(南京微盟); Supplier Footprint: SOT-23(SOT-23-3); JLCPCB Part Class: Extended Part; Datasheet: https://atta.szlcsc.com/upload/public/pdf/source/20180207/C161345_15179949863651359188.pdf; Supplier: LCSC; Voltage - Input (Max): 6V; Voltage Dropout (Max): 400mV @ 200mA; Output Current (Max): 300mA; Output Configuration: 正; Ripple Rejection (PSRR): 50dB(1kHz); Output Type: 固定; Number of Output Channels: 1; Operating Temperature: -25℃~125℃; Voltage - Output (Fixed): 3.3V
U2 = AXP2101: Supplier Part: C3036461; Manufacturer: Allwinner(全志); Supplier Footprint: QFN-40; JLCPCB Part Class: Extended Part; Datasheet: https://atta.szlcsc.comnull; Supplier: LCSC
C21 C26 = CC0402JRNPO9BN200: 容值:20pF;精度:±5%;额定电压:50V;材质(温度系数):NP0;; LCSC Part Name: 20pF ±5% 50V; Supplier Part: C107000; Manufacturer: YAGEO(国巨); Supplier Footprint: 0402; JLCPCB Part Class: Extended Part; Datasheet: https://atta.szlcsc.com/upload/public/pdf/source/20170420/1492670667698.pdf; Supplier: LCSC; Tolerance: ±5%; Voltage Rated: 50V; Temperature Coefficient: NP0
C25 = CC0402KRX7R9BB103: 容值:10nF;精度:±10%;额定电压:50V;温度系数:X7R;; LCSC Part Name: 10nF ±10% 50V; Supplier Part: C60133; Manufacturer: YAGEO(国巨); Supplier Footprint: 0402; JLCPCB Part Class: Extended Part; Datasheet: https://atta.szlcsc.com/upload/public/pdf/source/20151201/1457707601869.pdf; Supplier: LCSC; Tolerance: ±10%; Voltage Rated: 50V; Temperature Coefficient: X7R
C31 C38 C39 = CC0402KRX7R7BB102: 容值:1nF;精度:±10%;额定电压:16V;材质(温度系数):X7R;; LCSC Part Name: 1nF ±10% 16V; Supplier Part: C189467; Manufacturer: YAGEO(国巨); Supplier Footprint: 0402; JLCPCB Part Class: Extended Part; Datasheet: https://atta.szlcsc.com/upload/public/pdf/source/20181223/C189467_ECAE455788D8367352A380304B194A92.pdf; Supplier: LCSC; Tolerance: ±10%; Voltage Rated: 16V; Temperature Coefficient: X7R
C43 C44 C49 C51 = CL05A474KP5NNNC: 容值:470nF;精度:±10%;额定电压:10V;材质(温度系数):X5R;; LCSC Part Name: 470nF ±10% 10V; Supplier Part: C47339; Manufacturer: SAMSUNG(三星); Supplier Footprint: 0402; JLCPCB Part Class: Basic Part; Datasheet: https://atta.szlcsc.com/upload/public/pdf/source/20160103/1457707728896.pdf; Supplier: LCSC; Tolerance: ±10%; Voltage Rated: 10V; Temperature Coefficient: X5R
LED2 = MHT136CGCT: 发光颜色:普绿/黄绿;二极管配置:-;透镜颜色:无色透明;主波长:565.5nm~573.5nm;峰值波长:575nm;色温:-;光通量(25时):-;测试电流:5mA;正向电压(VF):1.9V;发光强度:18mcd;功率:60mW;发光角度:120°;安装方式:-;工作温度:-35~+85;; LCSC Part Name: LED贴片0402高亮黄绿色光; Supplier Part: C401111; Manufacturer: MEIHUA(美华科技); Supplier Footprint: 0402; JLCPCB Part Class: Extended Part; Datasheet: https://atta.szlcsc.com/upload/public/pdf/source/20190702/C401111_0A840381EC33404C0049AF0EC9B7006C.pdf; Supplier: LCSC; Emitted Color: 普绿/黄绿; Lens Color: 无色透明; Dominant Wavelength: 565.5nm~573.5nm; Peak Wavelength: 575nm; Forward Current: 5mA; Forward Voltage (VF): 1.9V; Luminous Intensity: 18mcd; Power Dissipation: 60mW; Viewing Angle: 120°; Operating Temperature: -35~+85
P2 = 1.27-1*3P针: 间距:1.27mm;总PIN位数:3;排数:1;插针结构:1x3P;行距:-;安装类型:直插;圆针/方针:方针;额定电流:3A;额定电压:-;配合针长度:3mm;塑高:1mm;端接针长度:2.3mm;触头材质:黄铜;触头镀层:-;工作温度范围:-55~+105;颜色:黑色;; LCSC Part Name: 1.27mm 1x3P 直插 方针; Supplier Part: C24980; Manufacturer: BOOMELE(博穆精密); Supplier Footprint: 插件,P=1.27mm; JLCPCB Part Class: Extended Part; Datasheet: https://atta.szlcsc.comnull; Supplier: LCSC; Pitch: 1.27mm; Number of Pins: 3; Number of Rows: 1; Pin Structure: 1x3P; Mounting Type: 直插; Circluar Pins/Square Pins: 方针; Current Rating (Max): 3A; Length of Mating Pin: 3mm; Insulation Height: 1mm; Length of End Connection Pin: 2.3mm; Contact Material: 黄铜; Operating Temperature Range: -55~+105; Color: 黑色
R7 R8 = 0402WGF330JTCE: 电阻类型:厚膜电阻;阻值:33Ω;精度:±1%;功率:1/16W;温度系数:±100ppm/;最大工作电压:50V;工作温度范围:-55~+155;; LCSC Part Name: 33Ω ±1% 1/16W; Supplier Part: C25105; Manufacturer: UNI-ROYAL(厚声); Supplier Footprint: 0402; JLCPCB Part Class: Basic Part; Datasheet: https://atta.szlcsc.com/upload/public/pdf/source/20200306/C422600_1E6D84923E4A46A82E41ADD87F860B5C.pdf; Supplier: LCSC; Type: 厚膜电阻; Tolerance: ±1%; Power(Watts): 1/16W; Temperature Coefficient: ±100ppm/; Overload Voltage (Max): 50V; Operating Temperature Range: -55~+155
R9 R12 = AC0402FR-070RL: 电阻类型:厚膜电阻;阻值:0Ω;精度:-;功率:62.5mW;温度系数:-;最大工作电压:50V;工作温度范围:-55~+155;; LCSC Part Name: 0Ω 62.5mW; Supplier Part: C226739; Manufacturer: YAGEO(国巨); Supplier Footprint: 0402; JLCPCB Part Class: Extended Part; Datasheet: https://atta.szlcsc.com/upload/public/pdf/source/20181022/C226739_BA43DB715E368E97C86C650480EF7962.pdf; Supplier: LCSC; Type: 厚膜电阻; Power(Watts): 62.5mW; Overload Voltage (Max): 50V; Operating Temperature Range: -55~+155
U3 = V831: Manufacturer: Allwinner(全志)
U4 = CSNP1GCR01-BOW: 免驱动使用，标准SDIO接口，兼容SPI/SD/eMMC接口，兼容各大MCU平台;内置EDC/ECC，坏块管理，垃圾回收算法;可机贴，锁定晶圆和控制器,一致性高；内置SLC晶圆,10W次擦写寿命，通过1万次随机掉电测试，支持工业级温度-40°~+85°。 CS(创世) SD NAND也被很多开发者朋友称为：贴片式TF卡，贴片式SD卡，贴片卡，焊接式SD卡，焊接式TF卡，工业级TF卡，工业级SD卡，嵌入式SD卡等。主要解决了主控(比如STM32系列的MCU单片机 )使用 SLC NAND FLASH,SPI; LCSC Part Name: 1Gb SD NAND 一代 SD NAND 一代; Supplier Part: C2691593; Manufacturer: CS(创世); Supplier Footprint: LGA8-6*8mm; JLCPCB Part Class: Extended Part; Datasheet: https://atta.szlcsc.com/upload/public/pdf/source/20210222/C2691593_195F15B6690BC3EBF1684FE727FBFF20.pdf; Supplier: LCSC
X1 = X201624MKB4SI: 晶振类型:贴片无源晶振;频率:24MHz;频率公差:±10ppm;频率稳定度:±20ppm;负载电容:8pF;工作温度:-40~+85;; LCSC Part Name: 24MHz ±10ppm 8pF; Supplier Part: C2682776; Manufacturer: YXC(扬兴科技); Supplier Footprint: SMD2016-4P; JLCPCB Part Class: Extended Part; Datasheet: https://atta.szlcsc.com/upload/public/pdf/source/20210329/C108154_97241DDF47B5B71D7D93F8906D63DA2F.pdf; Supplier: LCSC; Crystal Type: 贴片无源晶振; Frequency Tolerance: ±10ppm; Frequency Stability: ±20ppm; Load Capacitance: 8pF; Operating Temperature: -40~+85
C46 = CL05C5R6CB5NNNC: 容值:5.6pF;精度:±0.25pF;额定电压:50V;材质(温度系数):C0G;; LCSC Part Name: 5.6pF ±0.25pF 50V; Supplier Part: C318596; Manufacturer: SAMSUNG(三星); Supplier Footprint: 0402; JLCPCB Part Class: Extended Part; Datasheet: https://atta.szlcsc.com/upload/public/pdf/source/20181113/C318596_1010C5508B129AD2894F8A3BE5AAC215.pdf; Supplier: LCSC; Tolerance: ±0.25pF; Voltage Rated: 50V; Temperature Coefficient: C0G
C47 C48 = CC0402KRX5R5BB105: 容值:1uF;精度:±10%;额定电压:6.3V;材质(温度系数):X5R;; LCSC Part Name: 1uF ±10% 6.3V; Supplier Part: C106253; Manufacturer: YAGEO(国巨); Supplier Footprint: 0402; JLCPCB Part Class: Extended Part; Datasheet: https://atta.szlcsc.com/upload/public/pdf/source/20170505/1493957840703.pdf; Supplier: LCSC; Tolerance: ±10%; Voltage Rated: 6.3V; Temperature Coefficient: X5R
C54 C56 = CAP0402_RF: Supplier Footprint: 0402
C55 = CL05A475MQ5NRNC: 容值:4.7uF;精度:±20%;额定电压:6.3V;材质(温度系数):X5R;; LCSC Part Name: 4.7uF ±20% 6.3V; Supplier Part: C307423; Manufacturer: SAMSUNG(三星); Supplier Footprint: 0402; JLCPCB Part Class: Extended Part; Datasheet: https://atta.szlcsc.com/upload/public/pdf/source/20181010/C307423_0E0C4E35F3A09F81C2E5C84E00499E42.pdf; Supplier: LCSC; Tolerance: ±20%; Voltage Rated: 6.3V; Temperature Coefficient: X5R
L5 = SWPA252010S2R2MT: 电感值:2.2uH;精度:±30%;额定电流:-;直流电阻(DCR):-;; LCSC Part Name: 2.2uH ±30%; Supplier Part: C36399; Manufacturer: Sunlord(顺络); Supplier Footprint: SMD; JLCPCB Part Class: Extended Part; Datasheet: https://atta.szlcsc.com/upload/public/pdf/source/20210916/AC798BA7E846B7D0B6818F45CD84DB0B.pdf; Supplier: LCSC; Tolerance: ±30%
L6 = L0201_RF: Supplier Footprint: 0201; Q @ Freq: 20@500MHz
L7 = AN9520-245: 2.4G陶瓷天线/适用于WIFI蓝牙; Supplier Part: C99665; Manufacturer: rainsun台湾霖昱微; Supplier Footprint: 贴片; JLCPCB Part Class: Extended Part; Datasheet: https://atta.szlcsc.com/upload/public/pdf/source/20170425/1493115807294.pdf; Supplier: LCSC; Frequency Range: 2.45GHz
R13-R17 = 0402WGF3302TCE: 电阻类型:厚膜电阻;阻值:33kΩ;精度:±1%;功率:62.5mW;温度系数:±100ppm/℃;最大工作电压:50V;工作温度范围:-55℃~+155℃;; LCSC Part Name: 33kΩ ±1% 62.5mW; Supplier Part: C25779; Manufacturer: UNI-ROYAL(厚声); Supplier Footprint: 0402; JLCPCB Part Class: Basic Part; Datasheet: https://atta.szlcsc.com/upload/public/pdf/source/20200306/C422600_1E6D84923E4A46A82E41ADD87F860B5C.pdf; Supplier: LCSC; Type: 厚膜电阻; Tolerance: ±1%; Power(Watts): 62.5mW; Temperature Coefficient: ±100ppm/℃; Overload Voltage (Max): 50V; Operating Temperature Range: -55℃~+155℃
U5 = XR829: Supplier Footprint: QFN-40

## Nets
AGND: C42.2 C43.2 C44.2 R9.1 U3.58(AGND)
AVCC: C8.1 C27.1 C28.1 C32.2 C33.2 C40.1 C42.1 R1.1 R2.1 U2.18(ALDO1) U3.14(VCC_PLL) U3.18(VCC-RTC) U3.23(VCC_PE) U3.46(VCC18_IO) U3.55(AVCC) U3.75(VCC_MCSI)
GND: C1.1 C2.2 C3.1 C4.1 C5.2 C6.2 C7.2 C8.2 C9.2 C10.2 C11.2 C12.2 C13.1 C14.1 C15.1 C16.1 C17.2 C18.2 C19.2 C20.2 C21.2 C22.2 C23.1 C24.2 C25.2 C26.1 C27.2 C28.2 C29.2 C30.2 C31.1 C32.1 C33.1 C34.1 C35.2 C36.2 C37.2 C38.1 C39.1 C40.2 C41.2 C45.2 C46.2 C47.1 C48.1 C49.2 C50.2 C51.2 C52.1 C53.1 C54.1 C55.1 C56.1 C57.1 C58.1 C59.1 C60.1 C61.2 C62.2 D1.1 D3.1 D4.2 D5.2 D6.2 D7.1 D8.1 P1.2 P2.1 P3.1 P4.3 P4.8 P4.16 P4.18 P4.20 R4.1 R9.2 R18.1 R19.1 R20.1 SW1.3 SW1.4 SW2.3 SW2.4 U1.1(VSS) U2.3(GND) U2.41(EP) U3.13(PF6/PF_EINT6) U3.89(EPAD) U4.4(VSS) U5.4(XTAL1) U5.19(TEN) U5.20(LPCLK) U5.25(LDO_SEL) U5.41(EP) U6.5(GND) U6.9(OE#) U8.3 U10.8(VSSA) U10.23(VSS) U10.35(VSS) U10.44(BOOT0) U10.47(VSS) USB1.1(EP) USB1.2(EP) USB1.3(EP) USB1.4(EP) USB1.A1(GND) USB1.A12(GND) USB1.B1(GND) USB1.B12(GND) X1.2(GND) X1.4(GND)
V831_USB_DM: U3.77(USB0_DM) U6.7(HSD2-)
V831_USB_DP: U3.76(USB0_DP) U6.3(HSD2+)
VBAT: C1.2 C5.1 P1.1 U1.3(VIN) U2.33(BAT)
VBUS: U9.1 USB1.A4(VBUS) USB1.A9(VBUS) USB1.B4(VBUS) USB1.B9(VBUS)
VCC: C3.2 P4.19 U2.37(VBUS) U9.2
VCC_CARD: C17.1 C29.1 C30.1 C41.1 C45.1 L1.2 R10.1 R11.1 U2.21(FB1) U3.6(VCC_PD) U3.29(VCC_PG) U3.53(VCC_IO) U4.8(VCC)
VCC_DRAM: C19.1 C22.1 C23.2 C24.1 C25.1 L3.2 U2.9(FB4) U3.34(VCC_DRAM0) U3.35(VCC_DRAM1)
VCC_JLINK3.3: P4.15 R23.2 U7.2
VCC_JLINKOUT: P4.1 P4.2 P4.14 P4.17
VCC_WIFI_IO: R13.2 R14.2 R15.2 R16.2 R17.2
AP_WAKE_BT: U3.44(PH6/PWM_6/RMII_RXD0/TWI2_SDA/UART2_RX) U5.5(BT_HOST_WKUP)
BT_RESETN: U3.48(PH4/PWM_4/I2S0_DIN/SPI1_CS1/ONEWIRE) U5.23(BT_RSTN)
BT_UART_CTS: U3.49(PH3/PWM_3/I2S0_DOUT/SPI1_CS0/UART3_RTS) U5.8(UART_CTS)
BT_UART_RTS: U3.50(PH2/PWM_2/I2S0_LRCK/SPI1_MISO/UART3_CTS) U5.7(UART_RTS)
BT_UART_RX: U3.52(PH0/PWM_0/I2S0_MCLK/SPI1_CLK/UART3_TX) U5.9(UART_RX)
BT_UART_TX: U3.51(PH1/PWM_1/I2S0_BCLK/SPI1_MOSI/UART3_RX) U5.10(UART_TX)
BT_WAKE_AP: U3.43(PH7/PWM_7/RMII_CRS_DV/UART0_TX/UART2_RTS) U5.6(BT_WKUP_HOST)
JLINK_RST: C57.2 P3.4 R21.2 U10.7(NRST)
JLINK_RX: LED7.1(K) P4.13 R29.2
JLINK_TX: P4.11 R30.2
JLINK_USB_DM: R28.2 U6.6(D-)
JLINK_USB_DP: R27.2 U6.4(D+)
PMU_IRQ: D2.2(A) U3.88(PD8/LCD_D12/PWM_7/VO_D7/RMII_TXEN)
PMU_PWROK: C31.2 U2.29(PWROK) U3.19(RESET)
PMU_PWRON: D1.2 R6.1 SW1.1 SW1.2
PMU_SCL: R2.2 U2.40(SCK) U3.22(PE16/TWI0_SCK)
PMU_SDA: R1.2 U2.39(SDA) U3.21(PE17/TWI0_SDA)
RESET: P4.9 R24.1
RFCLK: U3.17(REFCLK_OUT) U5.3(XTAL2)
SDC0_CLK: R8.2 U4.3(SCLK)
SDC0_CMD: U3.10(PF3/SDC0_CMD/JTAG_DO) U4.5(CMD)
SDC0_D0: U3.8(PF1/SDC0_D0/JTAG_DI/CPU_BIST1) U4.6(SDD0)
SDC0_D1: U3.7(PF0/SDC0_D1/JTAG_MS/CPU_BIST0) U4.7(SDD1)
SDC0_D2: U3.12(PF5/SDC0_D2/JTAG_CK) U4.1(SDD2)
SDC0_D3: U3.11(PF4/SDC0_D3/UART0_RX) U4.2(CD/SDD3)
SWC_IN: P3.3 U10.37(PA14)
SWCLK: P4.7 P4.12 R25.1
SWD_IN: P3.2 U10.34(PA13)
SWDIO: P4.5 P4.10 R26.1
UART0_RX: P2.2 U3.40(PH10/RMII_TXD0/TWI3_SDA/UART0_RX)
UART0_TX: P2.3 U3.41(PH9/PWM_9/RMII_TXD1/TWI3_SCK/UART0_TX)
USB_DM: U6.8(HSD1-) U8.1 USB1.A7(DN1) USB1.B7(DN2)
USB_DP: U6.2(HSD1+) U8.2 USB1.A6(DP1) USB1.B6(DP2)
USB_SWITCH: R19.2 U3.68(PC5/SDC2_D4/SPI0_HOLD) U6.1(S)
VALDO3: C9.1 C58.2 C59.2 C60.2 C61.1 C62.1 R21.1 R22.1 R31.2 R32.2 U2.16(ALDO3) U6.10(V+) U10.1(VBAT) U10.9(VDDA) U10.24(VDD) U10.36(VDDIO) U10.48(VDD)
VBLDO1: C11.1 C47.2 R12.2 U2.12(BLDO1) U5.11(VDD_IO) U5.30(VBAT) U5.37(VBAT)
VBLDO2: C12.1 R12.1 U2.14(BLDO2)
VDCDC2: C18.1 C34.2 C35.1 C36.1 C37.1 C38.2 C39.2 L2.2 U2.26(FB2) U3.1(VDD_SYS0) U3.20(VDD_SYS1) U3.24(VDD_SYS2) U3.45(VDD_SYS3) U3.62(VDD_SYS4)
VDCDC5: C20.1 L4.2 LED4.2(A) U2.32(GPIO1/FB5/RTC/LDO2) U7.1
VSYS: C4.2 C7.1 C10.1 C14.2 C15.2 C16.2 LED1.2(A) U2.7(VIN4) U2.13(BLDOIN) U2.17(ALDOIN) U2.23(VIN1) U2.24(VIN2) U2.34(VSYS) U2.36(VMID)
WL_RESETN: U3.26(PG6/UART1_TX) U5.24(WL_RSTN)
WL_SDIO_CLK: C46.1 R7.1 U5.16(SDIO_CLK)
WL_SDIO_CMD: R17.1 U3.32(PG1/SDC1_CMD/UART3_RX) U5.12(SDIO_CMD)
WL_SDIO_D0: R16.1 U3.31(PG2/SDC1_D0/UART3_CTS) U5.13(SDIO_D0)
WL_SDIO_D1: R15.1 U3.30(PG3/SDC1_D1/UART3_RTS) U5.14(SDIO_D1)
WL_SDIO_D2: R14.1 U3.27(PG4/SDC1_D2/UART1_RTS) U5.17(SDIO_D2)
WL_SDIO_D3: R13.1 U3.28(PG5/SDC1_D3/UART1_CTS) U5.15(SDIO_D3)
WL_WAKE_AP: U3.25(PG7/UART1_RX) U5.35(WIRQ)
$1N12656: C43.1 U3.59(VRA2)
$1N12908: C44.1 U3.57(VRA1)
$1N16208: C26.2 U3.15(DXOUT) X1.3(OSC2)
$1N20830: R7.2 U3.33(PG0/SDC1_CLK/UART3_TX)
$1N21788: C21.1 U3.16(DXIN) X1.1(OSC1)
$1N38721: R8.1 U3.9(PF2/SDC0_CLK/UART0_TX)
$1N45957: LED2.2(A) R10.2
$1N46132: LED2.1(K) U3.66(PC3/SPI0_MISO/SDC2_CMD)
$1N73746: D3.2 SW2.1 SW2.2 U3.64(PC1/SPI0_CS0/SDC2_RST)
$1N73815: LED3.1(K) U3.67(PC4/SDC2_D3/SPI0_WP)
$1N73851: LED3.2(A) R11.2
$2N664: L1.1 U2.22(LX1)
$2N5027: L3.1 U2.8(LX4)
$2N5965: L4.1 U2.35(SW)
$2N10495: R4.2 U2.31(TS)
$2N11092: C6.1 U2.2(VREF)
$2N11570: LED1.1(K) R5.1
$2N11617: R5.2 U2.1(CHGLED)
$2N15237: C13.2 R6.2 U2.30(PWRON)
$2N32332: C2.1 R3.1 U1.2(VOUT)
$2N34344: L2.1 U2.25(LX2)
$2N38791: D2.1(K) R3.2 U2.38(IRQ)
$3N23741: C52.2 C53.2 C55.2 L5.2 U5.1(VDD14_RX) U5.22(VDD14_DIG) U5.28(VDD_SENSE) U5.36(VDD14_TX)
$3N23892: L5.1 U5.29(VDD_VLX)
$3N25604: C49.1 U5.2(VDD12_CLK)
$3N25806: C51.1 U5.26(VDD_RTC)
$3N25918: C48.2 U5.38(VDD33_PA)
$3N27722: C56.2 L6.2 L7.1
$3N28512: C50.1 U5.21(VDD12_DIG)
$3N38594: C54.2 L6.1 U5.40(ANT)
$4N1560: LED5.1(K) U10.10(PA0)
$4N1563: LED5.2(A) R22.2
$4N2188: R28.1 U10.32(PA11)
$4N2309: R27.1 U10.33(PA12)
$4N9709: D4.1 R24.2 U10.11(PA1)
$4N9748: D5.1 R25.2 U10.12(PA2)
$4N9789: D6.1 R26.2 U10.14(PA4)
$4N13286: D8.2 R29.1 U10.31(PA10)
$4N13859: LED7.2(A) R32.1
$4N14179: D7.2 LED6.1(K) R30.1 U10.30(PA9)
$4N14227: LED6.2(A) R31.1
$4N30757: LED4.1(K) R23.1
$4N31270: R18.2 USB1.A5(CC1)
$4N31271: R20.2 USB1.B5(CC2)

Not connected (* = marked no-connect by the designer): L7 2*; P4 4* 6*; U2 4(FB3)* 5(LX3)* 6(VIN3)* 10(CPULDOS)* 11(DLDO2/DC4SW)* 15(ALDO4)* 19(ALDO2)* 20(DLDO1/DC1SW)* 27(VBACKUP)* 28(VRTC)*; U3 2(PD18/LCD_CLK/VO_CLK/EPHY_25M)* 3(PD19/LCD_DE/PWM_9/VO_FIELD/TCON_TRIG)* 4(PD20/LCD_HSYNC/VO_HSYNC/MDC)* 5(PD21/LCD_VSYNC/VO_VSYNC/MDIO)* 36(PH14/JTAG_DI/MDIO/SPI1_CS0/TWI3_SDA)* 37(PH13/JTAG_DO/MDC/SPI1_MISO/TWI3_SCK)* 38(PH12/JTAG_CK/RMII_TXEN/SPI1_MOSI/TWI2_SDA)* 39(PH11/JTAG_MS/RMII_TXCK/SPI1_CLK/TWI2_SCK)* 42(PH8/PWM_8/RMII_RXER/UART0_RX/UART2_CTS)* 47(PH5/PWM_5/RMII_RXD1/TWI2_SCK/UART2_TX)* 54(GPADC0)* 56(LINEOUTP)* 60(MICIN1N)* 61(MICIN1P)* 63(PC0/SPI0_CLK/SDC2_DS)* 65(PC2/SPI0_MOSI/SDC2_CLK)* 69(MCSIA_D0N)* 70(MCSIA_D0P)* 71(MCSIA_D1P)* 72(MCSIA_D1N)* 73(MCSIA_CKN)* 74(MCSIA_CKP)* 78(PI0/CSI_MASTERCLK0)* 79(PI1/CSI_SM_HS/SPI2_CLK/TWI1_SCK)* 80(PI2/CSI_SM_VS/SPI2_MOSI/TWI1_SDA)* 81(PD1/LCD_D3/PWM_0/VO_D0/RMII_RXD1)* 82(PD2/LCD_D4/PWM_1/VO_D1/RMII_RXD0)* 83(PD3/LCD_D5/PWM_2/VO_D2/RMII_CRS_DV)* 84(PD4/LCD_D6/PWM_3/VO_D3/RMII_RXER)* 85(PD5/LCD_D7/PWM_4/VO_D4/RMII_TXD1)* 86(PD6/LCD_D10/PWM_5/VO_D5/RMII_TXD0)* 87(PD7/LCD_D11/PWM_6/VO_D6/RMII_TXCK)*; U5 18(CLKREQO)* 27(VDD25_EF)* 31(PCM_CLK)* 32(PCM_OUT)* 33(PCM_IN)* 34(PCM_SYNC)* 39(NC)*; U10 2(PC13)* 3(PC14/OSC32_IN)* 4(PC15/OSC32_OUT)* 5(PF0/OSC_IN)* 6(PF1/OSC_OUT)* 13(PA3)* 15(PA5)* 16(PA6)* 17(PA7)* 18(PB0)* 19(PB1)* 20(PB2)* 21(PB10)* 22(PB11)* 25(PB12)* 26(PB13)* 27(PB14)* 28(PB15)* 29(PA8)* 38(PA15)* 39(PB3)* 40(PB4)* 41(PB5)* 42(PB6)* 43(PB7)* 45(PB8)* 46(PB9)*; USB1 A8(SUB1)* B8(SUB2)*

## Notes on the sheets
sheet 2
- 3.3V
- 0.9V
- 1.8V
- 3.3V
- 1.8V
- 3.3V
- 3.3V
- 3.3V
- 若需使用关机功能，IRQ必须为高电平，
  默认IRQ低电平持续16ms自动开机
